# Altium project AG1280.PrjPcb
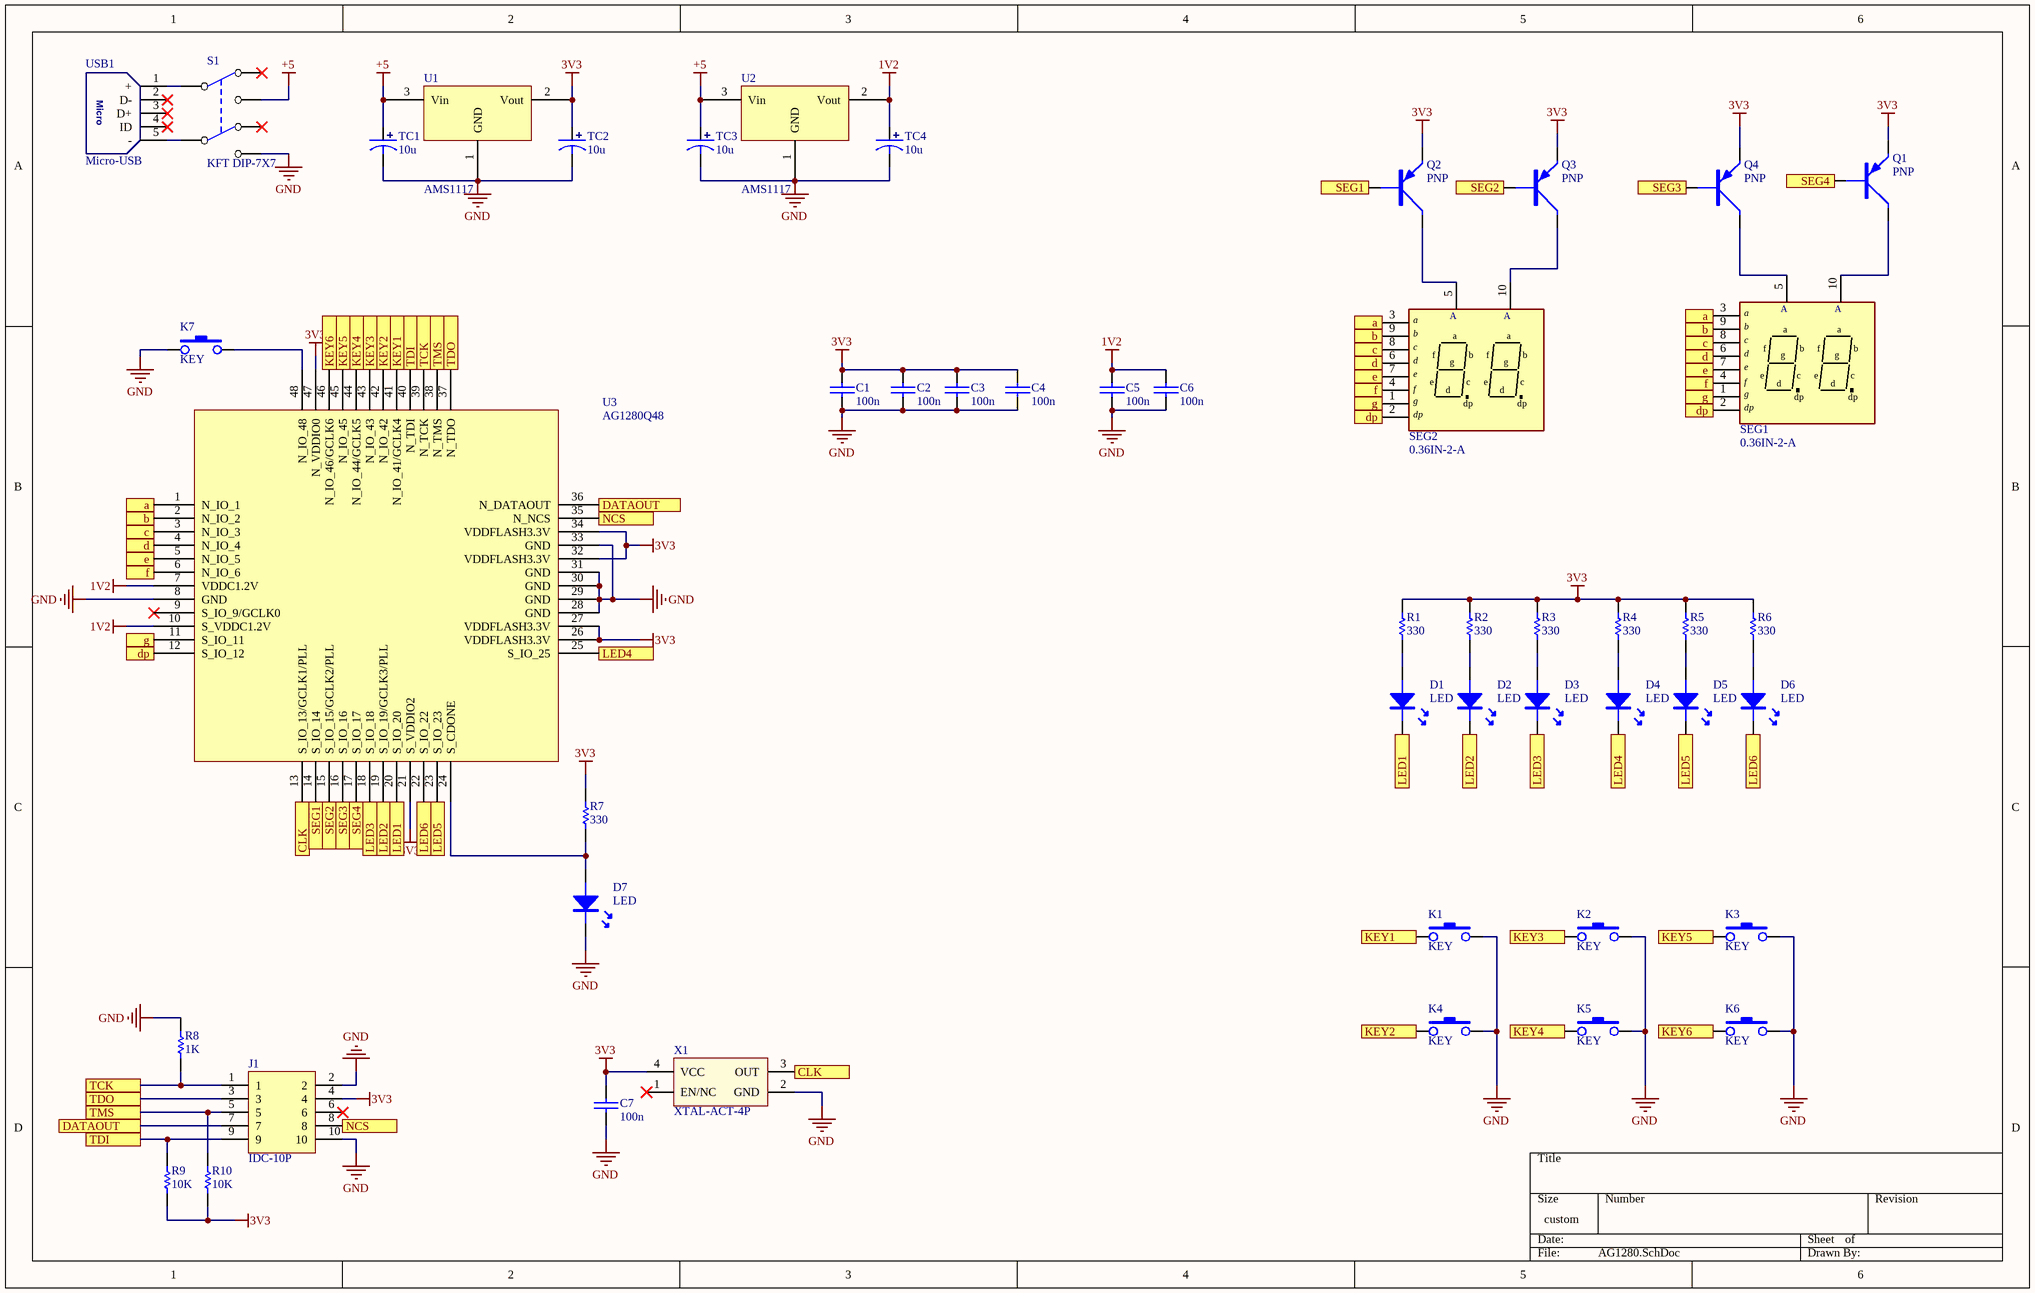
[diagram p0: AG1280.SchDoc]
1 sheet, 48 parts. Net scope: flat (ports and power ports of the same name join across sheets).
Board file: AG1280.PcbDoc

## Sheet AG1280.SchDoc
size 381 x 241 mm; SheetNumber: 1; SheetTotal: 1

### Parts
C1  100n  [0603C]
C2  100n  [0603C]
C3  100n  [0603C]
C4  100n  [0603C]
C5  100n  [0603C]
C6  100n  [0603C]
C7  100n  [0603C]
D1  LED  [LED-0603B]
D2  LED  [LED-0603B]
D3  LED  [LED-0603B]
D4  LED  [LED-0603B]
D5  LED  [LED-0603B]
D6  LED  [LED-0603B]
D7  LED  [LED-0603B]
J1  IDC-10P  [IDC2.54-10P]
K1  KEY  [DIP-6X6X6]
K2  KEY  [DIP-6X6X6]
K3  KEY  [DIP-6X6X6]
K4  KEY  [DIP-6X6X6]
K5  KEY  [DIP-6X6X6]
K6  KEY  [DIP-6X6X6]
K7  KEY  [DIP-6X6X6]
Q1  PNP  [SOT-23]
Q2  PNP  [SOT-23]
Q3  PNP  [SOT-23]
Q4  PNP  [SOT-23]
R1  330  [0603R]
R2  330  [0603R]
R3  330  [0603R]
R4  330  [0603R]
R5  330  [0603R]
R6  330  [0603R]
R7  330  [0603R]
R8  1K  [0603R]
R9  10K  [0603R]
R10  10K  [0603R]
S1  KFT DIP-7X7  [KFT DIP-7X7]
SEG1  0.36IN-2-A  [0.36IN-2P]
SEG2  0.36IN-2-A  [0.36IN-2P]
TC1  10u  [TAJ-A/3216]
TC2  10u  [TAJ-A/3216]
TC3  10u  [TAJ-A/3216]
TC4  10u  [TAJ-A/3216]
U1  AMS1117  [SOT223]
U2  AMS1117  [SOT223]
U3  AG1280Q48  [QFN48 6X6]
USB1  Micro-USB  [USB-micro_B]
X1  XTAL-ACT-4P  [OSC 3225-4P]

### Ports
a, b, c, CLK, d, DATAOUT, dp, e, f, g, KEY1, KEY2, KEY3, KEY4, KEY5, KEY6, LED1, LED2, LED3, LED4, LED5, LED6, NCS, SEG1, SEG2, SEG3, SEG4, TCK, TDI, TDO, TMS

### Nets
1V2: C5.2 C6.2 TC4.1 U2.2(Vout) U3.7(VDDC1.2V) U3.10(S_VDDC1.2V)
3V3: C1.2 C2.2 C3.2 C4.2 C7.2 J1.4 Q1.E Q2.E Q3.E Q4.E R1.2 R2.2 R3.2 R4.2 R5.2 R6.2 R7.2 R9.1 R10.1 TC2.1 U1.2(Vout) U3.21(S_VDDIO2) U3.26(VDDFLASH3.3V) U3.27(VDDFLASH3.3V) U3.32(VDDFLASH3.3V) U3.34(VDDFLASH3.3V) U3.47(N_VDDIO0) X1.4(VCC)
+5: S1.1 TC1.1 TC3.1 U1.3(Vin) U2.3(Vin)
GND: C1.1 C2.1 C3.1 C4.1 C5.1 C6.1 C7.1 D7.K J1.2 J1.10 K1.3 K2.3 K3.3 K4.3 K5.3 K6.3 K7.1 R8.2 S1.6 TC1.2 TC2.2 TC3.2 TC4.2 U1.1(GND) U2.1(GND) U3.8(GND) U3.28(GND) U3.29(GND) U3.30(GND) U3.31(GND) U3.33(GND) X1.2(GND)
NetD1_A: D1.A R1.1
NetD1_K: D1.K U3.20(S_IO_20) ; port LED1
NetD2_A: D2.A R2.1
NetD2_K: D2.K U3.19(S_IO_19/GCLK3/PLL) ; port LED2
NetD3_A: D3.A R3.1
NetD3_K: D3.K U3.18(S_IO_18) ; port LED3
NetD4_A: D4.A R4.1
NetD4_K: D4.K U3.25(S_IO_25) ; port LED4
NetD5_A: D5.A R5.1
NetD5_K: D5.K U3.23(S_IO_23) ; port LED5
NetD6_A: D6.A R6.1
NetD6_K: D6.K U3.22(S_IO_22) ; port LED6
NetD7_A: D7.A R7.1 U3.24(S_CDONE)
NetJ1_1: J1.1 R8.1 U3.39(N_TCK) ; port TCK
NetJ1_3: J1.3 U3.37(N_TDO) ; port TDO
NetJ1_5: J1.5 R10.2 U3.38(N_TMS) ; port TMS
NetJ1_7: J1.7 U3.36(N_DATAOUT) ; port DATAOUT
NetJ1_8: J1.8 U3.35(N_NCS) ; port NCS
NetJ1_9: J1.9 R9.2 U3.40(N_TDI) ; port TDI
NetK1_1: K1.1 U3.41(N_IO_41/GCLK4) ; port KEY1
NetK2_1: K2.1 U3.43(N_IO_43) ; port KEY3
NetK3_1: K3.1 U3.45(N_IO_45) ; port KEY5
NetK4_1: K4.1 U3.42(N_IO_42) ; port KEY2
NetK5_1: K5.1 U3.44(N_IO_44/GCLK5) ; port KEY4
NetK6_1: K6.1 U3.46(N_IO_46/GCLK6) ; port KEY6
NetK7_3: K7.3 U3.48(N_IO_48)
NetQ1_B: Q1.B U3.17(S_IO_17) ; port SEG4
NetQ1_C: Q1.C SEG1.10
NetQ2_B: Q2.B U3.14(S_IO_14) ; port SEG1
NetQ2_C: Q2.C SEG2.5
NetQ3_B: Q3.B U3.15(S_IO_15/GCLK2/PLL) ; port SEG2
NetQ3_C: Q3.C SEG2.10
NetQ4_B: Q4.B U3.16(S_IO_16) ; port SEG3
NetQ4_C: Q4.C SEG1.5
NetS1_2: S1.2 USB1.1(+)
NetS1_5: S1.5 USB1.5(-)
NetSEG1_1: SEG1.1 SEG2.1 U3.11(S_IO_11) ; port g
NetSEG1_2: SEG1.2 SEG2.2 U3.12(S_IO_12) ; port dp
NetSEG1_3: SEG1.3 SEG2.3 U3.1(N_IO_1) ; port a
NetSEG1_4: SEG1.4 SEG2.4 U3.6(N_IO_6) ; port f
NetSEG1_6: SEG1.6 SEG2.6 U3.4(N_IO_4) ; port d
NetSEG1_7: SEG1.7 SEG2.7 U3.5(N_IO_5) ; port e
NetSEG1_8: SEG1.8 SEG2.8 U3.3(N_IO_3) ; port c
NetSEG1_9: SEG1.9 SEG2.9 U3.2(N_IO_2) ; port b
NetU3_13: U3.13(S_IO_13/GCLK1/PLL) X1.3(OUT) ; port CLK

Not connected (* = marked no-connect by the designer): J1 6*; S1 3* 4*; U3 9(S_IO_9/GCLK0)*; USB1 2(D-)* 3(D+)* 4(ID)*; X1 1(EN/NC)*

### Notes on the sheet
- (in symbol 0.36IN-2-A) A; a; b; c; f; d; g; e; dp
- (in symbol Micro-USB) Micro

### Library data of the parts
C1-C7 = CAP: 无极性电容
Q1-Q4 = PNP: PNP三极管
R1-R10 = RES
SEG1 SEG2 = 0.36IN-2-A: 2位0.36寸共阳数码管
TC1-TC4 = TCAP: 钽电容
U1 U2 = AMS1117: 三端稳压芯片
X1 = XTAL-ACT-4P: 4脚有源晶振